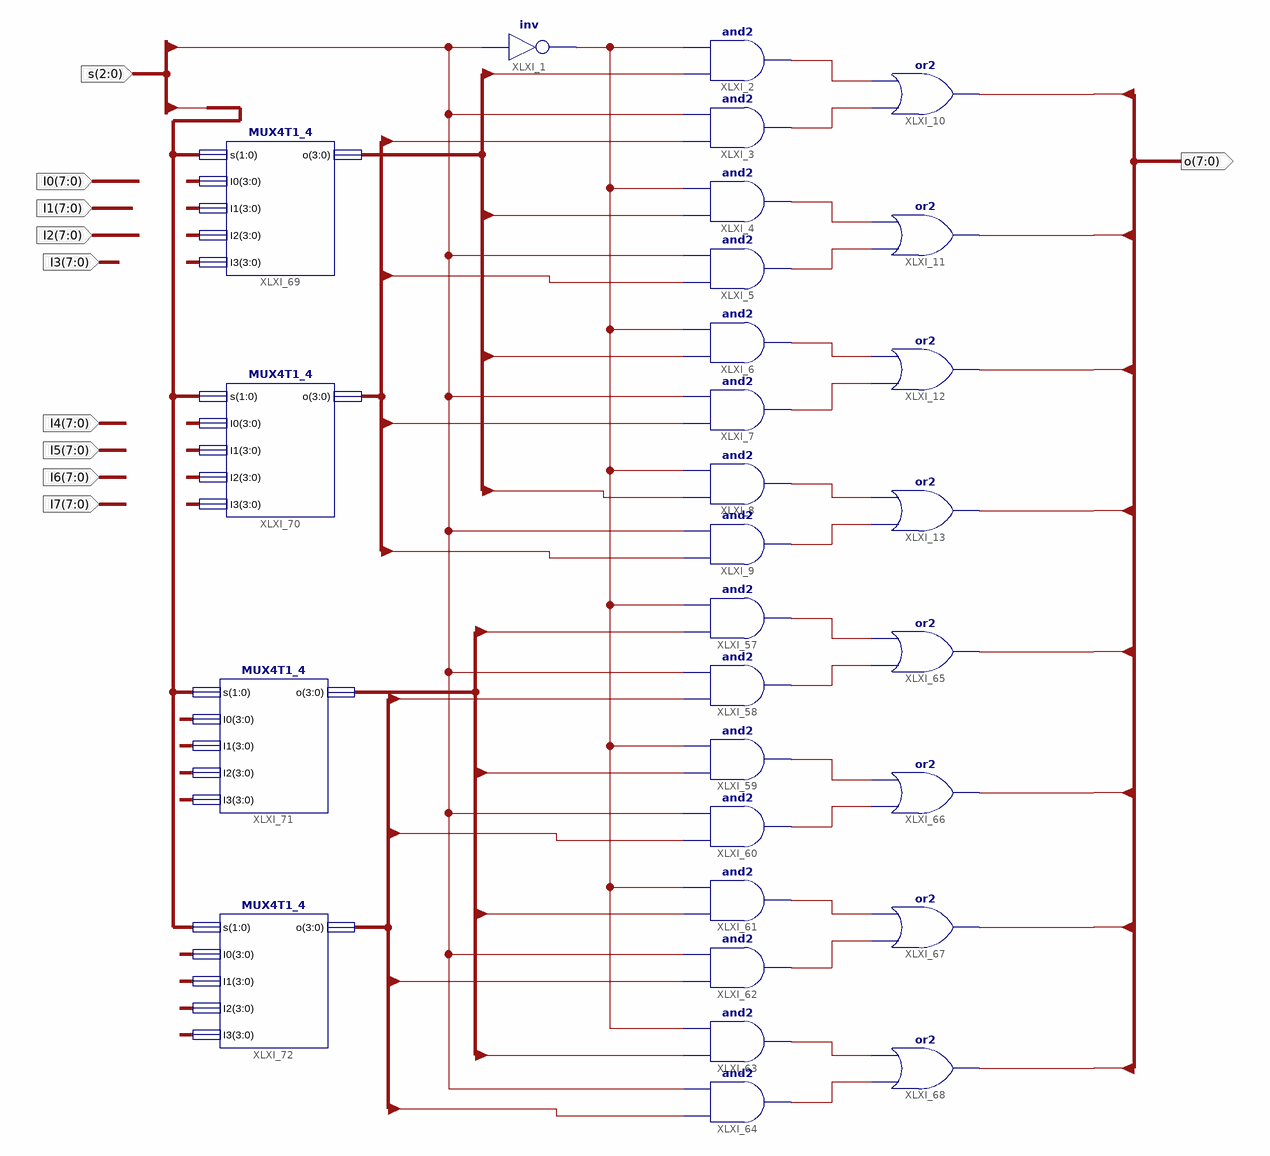
[diagram p0: schematic sheet 1]
// Xilinx ISE schematic MUX8T1_8.sch (artix7) as structural Verilog: 29 symbols, 10 ports
module MUX8T1_8 (
  input  [2:0] s,
  input  [7:0] I0,
  input  [7:0] I1,
  input  [7:0] I2,
  input  [7:0] I7,
  input  [7:0] I6,
  input  [7:0] I5,
  input  [7:0] I4,
  input  [7:0] I3,
  output [7:0] o
);

  wire XLXN_1, XLXN_2, XLXN_3, XLXN_4, XLXN_5, XLXN_6, XLXN_7, XLXN_8, XLXN_33, XLXN_34, XLXN_35, XLXN_36,
       XLXN_37, XLXN_38, XLXN_39, XLXN_40, XLXN_42;
  wire [3:0] o0, o1, o2, o3;

  not XLXI_1 (XLXN_42, s[2]);
  and XLXI_2 (XLXN_1, o0[0], XLXN_42);
  and XLXI_3 (XLXN_2, o1[0], s[2]);
  and XLXI_4 (XLXN_3, o0[1], XLXN_42);
  and XLXI_5 (XLXN_4, o1[1], s[2]);
  and XLXI_6 (XLXN_5, o0[2], XLXN_42);
  and XLXI_7 (XLXN_6, o1[2], s[2]);
  and XLXI_8 (XLXN_7, o0[3], XLXN_42);
  and XLXI_9 (XLXN_8, o1[3], s[2]);
  or XLXI_10 (o[0], XLXN_2, XLXN_1);
  or XLXI_11 (o[1], XLXN_4, XLXN_3);
  or XLXI_12 (o[2], XLXN_6, XLXN_5);
  or XLXI_13 (o[3], XLXN_8, XLXN_7);
  and XLXI_57 (XLXN_33, o2[0], XLXN_42);
  and XLXI_58 (XLXN_34, o3[0], s[2]);
  and XLXI_59 (XLXN_35, o2[1], XLXN_42);
  and XLXI_60 (XLXN_36, o3[1], s[2]);
  and XLXI_61 (XLXN_37, o2[2], XLXN_42);
  and XLXI_62 (XLXN_38, o3[2], s[2]);
  and XLXI_63 (XLXN_39, o2[3], XLXN_42);
  and XLXI_64 (XLXN_40, o3[3], s[2]);
  or XLXI_65 (o[4], XLXN_34, XLXN_33);
  or XLXI_66 (o[5], XLXN_36, XLXN_35);
  or XLXI_67 (o[6], XLXN_38, XLXN_37);
  or XLXI_68 (o[7], XLXN_40, XLXN_39);
  MUX4T1_4 XLXI_69 (.s(s[1:0]), .I0(I0[3:0]), .I1(I1[3:0]), .I2(I2[3:0]), .I3(I3[3:0]), .o(o0));
  MUX4T1_4 XLXI_70 (.s(s[1:0]), .I0(I4[3:0]), .I1(I5[3:0]), .I2(I6[3:0]), .I3(I7[3:0]), .o(o1));
  MUX4T1_4 XLXI_71 (.s(s[1:0]), .I0(I0[7:4]), .I1(I1[7:4]), .I2(I2[7:4]), .I3(I3[7:4]), .o(o2));
  MUX4T1_4 XLXI_72 (.s(s[1:0]), .I0(I4[7:4]), .I1(I5[7:4]), .I2(I6[7:4]), .I3(I7[7:4]), .o(o3));
endmodule
